# Altium project project-ui-v1.1.PrjPcb
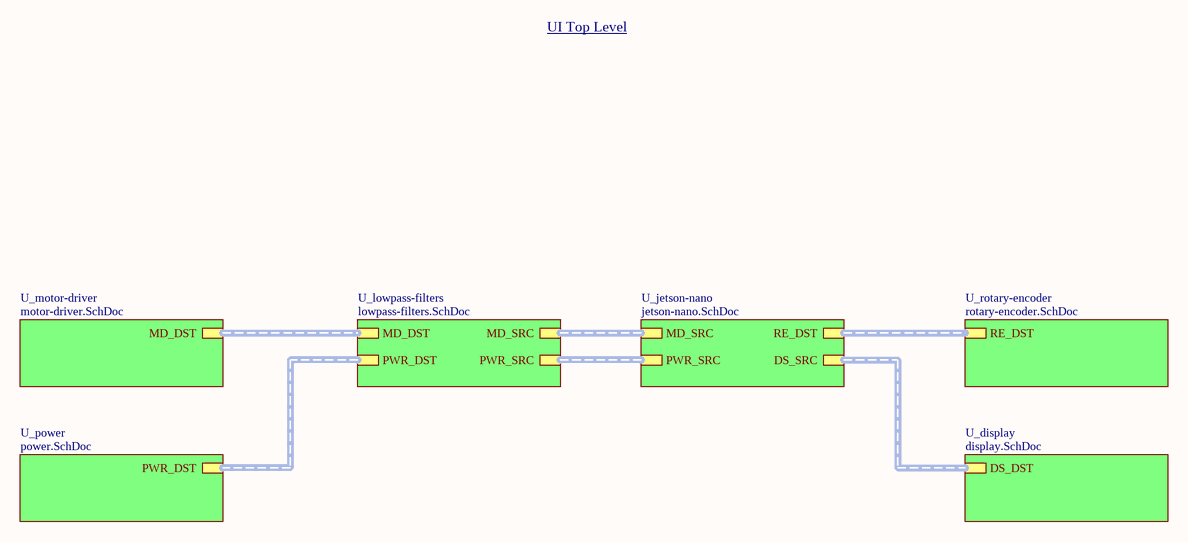
[diagram p0: ui-pcb.SchDoc]
8 sheets, 56 parts. Net scope: hierarchical (ports join the sheet entries above them; power ports are global).
Board file: ui_layout-v1.1.PcbDoc
Sheets:
  ui-pcb.SchDoc
    U_jetson-nano = jetson-nano.SchDoc
    U_lowpass-filters = lowpass-filters.SchDoc
      FL_MD_MUX_1 = low-pass-filter.SchDoc
      FL_MD_SCK = low-pass-filter.SchDoc
      FL_MD_MOSI = low-pass-filter.SchDoc
      FL_MD_MISO = low-pass-filter.SchDoc
      FL_MD_CS0 = low-pass-filter.SchDoc
      FL_MD_CS1 = low-pass-filter.SchDoc
      FL_MD_CS2 = low-pass-filter.SchDoc
      FL_MD_CS3 = low-pass-filter.SchDoc
      FL_MD_CS4 = low-pass-filter.SchDoc
      FL_MD_RESET = low-pass-filter.SchDoc
      FL_MD_EN = low-pass-filter.SchDoc
      FL_MD_MUX_0 = low-pass-filter.SchDoc
      FL_PWR_TX = low-pass-filter.SchDoc
      FL_PWR_RX = low-pass-filter.SchDoc
      FL_PWR_HRBT = low-pass-filter.SchDoc
    U_rotary-encoder = rotary-encoder.SchDoc
    U_display = display.SchDoc
    U_motor-driver = motor-driver.SchDoc
    U_power = power.SchDoc

## Sheet ui-pcb.SchDoc
size A4; SheetNumber: 1; SheetTotal: 8

### Sub-sheets
U_display = display.SchDoc: DS_DST (harness DS_SIGNALS)
U_jetson-nano = jetson-nano.SchDoc: DS_SRC (harness DS_SIGNALS), PWR_SRC (harness PWR_SIGNALS), MD_SRC (harness MD_SIGNALS), RE_DST (harness RE_SIGNALS)
U_lowpass-filters = lowpass-filters.SchDoc: PWR_SRC (harness PWR_SIGNALS), PWR_DST (harness PWR_SIGNALS), MD_SRC (harness MD_SIGNALS), MD_DST (harness MD_SIGNALS)
U_motor-driver = motor-driver.SchDoc: MD_DST (harness MD_SIGNALS)
U_power = power.SchDoc: PWR_DST (harness PWR_SIGNALS)
U_rotary-encoder = rotary-encoder.SchDoc: RE_DST (harness RE_SIGNALS)

### Buses and harness runs
harness sheet U_display/DS_DST = sheet U_jetson-nano/DS_SRC
harness sheet U_jetson-nano/MD_SRC = sheet U_lowpass-filters/MD_SRC
harness sheet U_jetson-nano/PWR_SRC = sheet U_lowpass-filters/PWR_SRC
harness sheet U_jetson-nano/RE_DST = sheet U_rotary-encoder/RE_DST
harness sheet U_lowpass-filters/MD_DST = sheet U_motor-driver/MD_DST
harness sheet U_lowpass-filters/PWR_DST = sheet U_power/PWR_DST

### Notes on the sheet
- UI Top Level

## Sheet jetson-nano.SchDoc
size A3
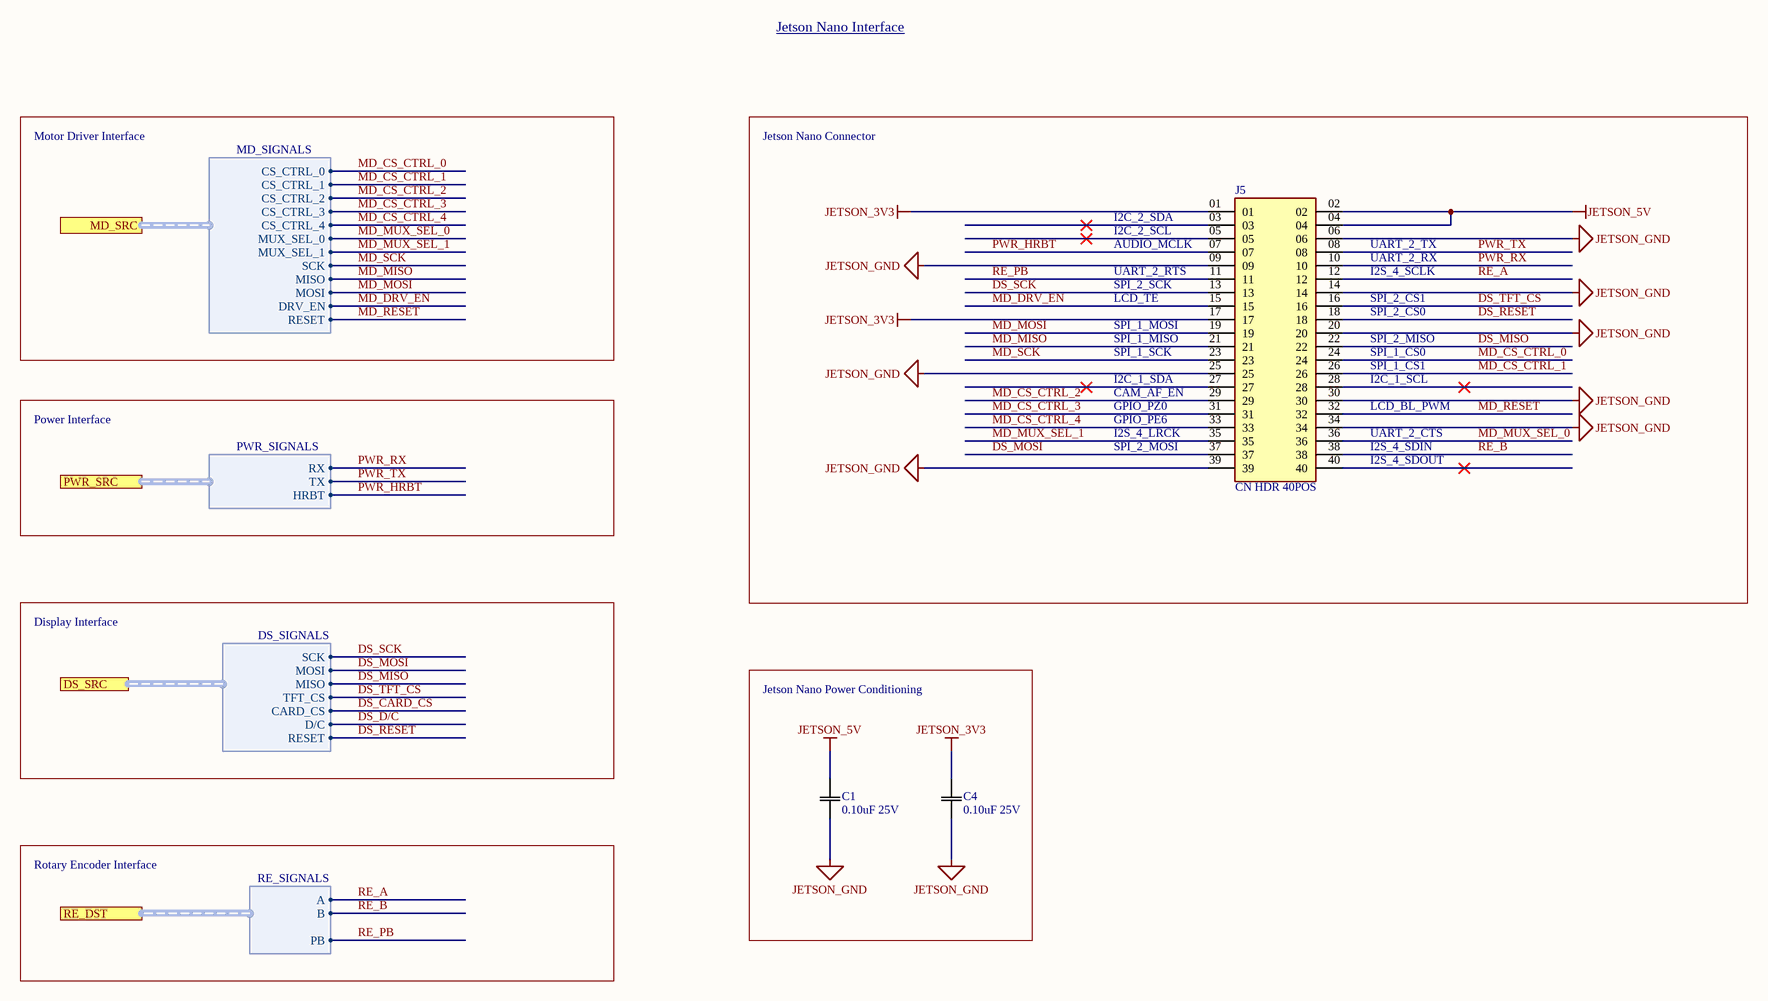
[diagram p1: jetson-nano.SchDoc]

### Parts
C1  0.10uF 25V  [0805]
C4  0.10uF 25V  [0805]
J5  CN HDR 40POS  [CN HDR 40POS 0.1 TH]

### Blocks framed on the sheet
Jetson Nano Power Conditioning: C1 C4

### Ports
DS_SRC (harness DS_SIGNALS), MD_SRC (harness MD_SIGNALS), PWR_SRC (harness PWR_SIGNALS), RE_DST (harness RE_SIGNALS)

### Harnesses
DS_SIGNALS: SCK, MOSI, MISO, TFT_CS, CARD_CS, D/C, RESET
PWR_SIGNALS: TX, RX, HRBT
MD_SIGNALS: CS_CTRL_0, MUX_SEL_1, SCK, MOSI, MISO, CS_CTRL_1, CS_CTRL_2, CS_CTRL_3, CS_CTRL_4, MUX_SEL_0, DRV_EN, RESET
RE_SIGNALS: A, B, PB

### Nets
JETSON_3V3: C4.2(C2) J5.01 J5.17
JETSON_5V: C1.2(C2) J5.02 J5.04
JETSON_GND: C1.1(C1) C4.1(C1) J5.06 J5.09 J5.14 J5.20 J5.25 J5.30 J5.34 J5.39
DS_MISO: J5.22 ; port DS_SRC.MISO
DS_MOSI: J5.37 ; port DS_SRC.MOSI
DS_RESET: J5.18 ; port DS_SRC.RESET
DS_SCK: J5.13 ; port DS_SRC.SCK
DS_TFT_CS: J5.16 ; port DS_SRC.TFT_CS
MD_CS_CTRL_0: J5.24 ; port MD_SRC.CS_CTRL_0
MD_CS_CTRL_1: J5.26 ; port MD_SRC.CS_CTRL_1
MD_CS_CTRL_2: J5.29 ; port MD_SRC.CS_CTRL_2
MD_CS_CTRL_3: J5.31 ; port MD_SRC.CS_CTRL_3
MD_CS_CTRL_4: J5.33 ; port MD_SRC.CS_CTRL_4
MD_DRV_EN: J5.15 ; port MD_SRC.DRV_EN
MD_MISO: J5.21 ; port MD_SRC.MISO
MD_MOSI: J5.19 ; port MD_SRC.MOSI  [project net MD_MISO_SRC]
MD_MUX_SEL_0: J5.36 ; port MD_SRC.MUX_SEL_0
MD_MUX_SEL_1: J5.35 ; port MD_SRC.MUX_SEL_1
MD_RESET: J5.32 ; port MD_SRC.RESET
MD_SCK: J5.23 ; port MD_SRC.SCK
PWR_HRBT: J5.07 ; port PWR_SRC.HRBT
PWR_RX: J5.10 ; port PWR_SRC.RX
PWR_TX: J5.08 ; port PWR_SRC.TX
RE_A: J5.12 ; port RE_DST.A  [project net A_SRC]
RE_B: J5.38 ; port RE_DST.B  [project net B_SRC]
RE_PB: J5.11 ; port RE_DST.PB  [project net PB_SRC]

Not connected (* = marked no-connect by the designer): J5 03* 05* 27* 28* 40*

### Notes on the sheet
- Jetson Nano Interface
- Motor Driver Interface
- Jetson Nano Connector
- AUDIO_MCLK
- UART_2_RTS
- I2C_2_SDA
- I2C_2_SCL
- I2S_4_SCLK
- UART_2_TX
- UART_2_RX
- LCD_TE
- SPI_2_SCK
- SPI_1_MOSI
- SPI_1_MISO
- SPI_2_CS1
- SPI_2_MISO
- SPI_2_CS0
- GPIO_PZ0
- CAM_AF_EN
- SPI_1_SCK
- I2C_1_SDA
- LCD_BL_PWM
- SPI_1_CS0
- SPI_1_CS1
- I2C_1_SCL
- Power Interface
- SPI_2_MOSI
- I2S_4_LRCK
- GPIO_PE6
- I2S_4_SDIN
- UART_2_CTS
- I2S_4_SDOUT
- Display Interface
- Rotary Encoder Interface

### Library data of the parts
C1 C4 = CAP 0.10uF 25V: CAP CER 0.10UF 25V X7R 0805; Value: 0.1uF; Tolerance: 10%; Temperature Coefficient: X7R; Rating: 25V; Part Number: CAP 0.10uF 25V; Operating Temperature: -55°C ~ 125°C
J5 = CN HDR 40POS: 40 Position Header Connector; Part Number: CN HDR 40POS; Supplier 1: Digi-Key; Supplier Part Number 1: S6104-ND; Supplier URL 1: https://www.digikey.ca/en/products/detail/sullins-connector-solutions/PPTC202LFBN-RC/807240?s=N4IgTCBcDaIMoDYCMAGALAWgHIBEQF0BfIA; Pin Count: 40

## Sheet lowpass-filters.SchDoc
size A3; SheetNumber: 1; SheetTotal: 6
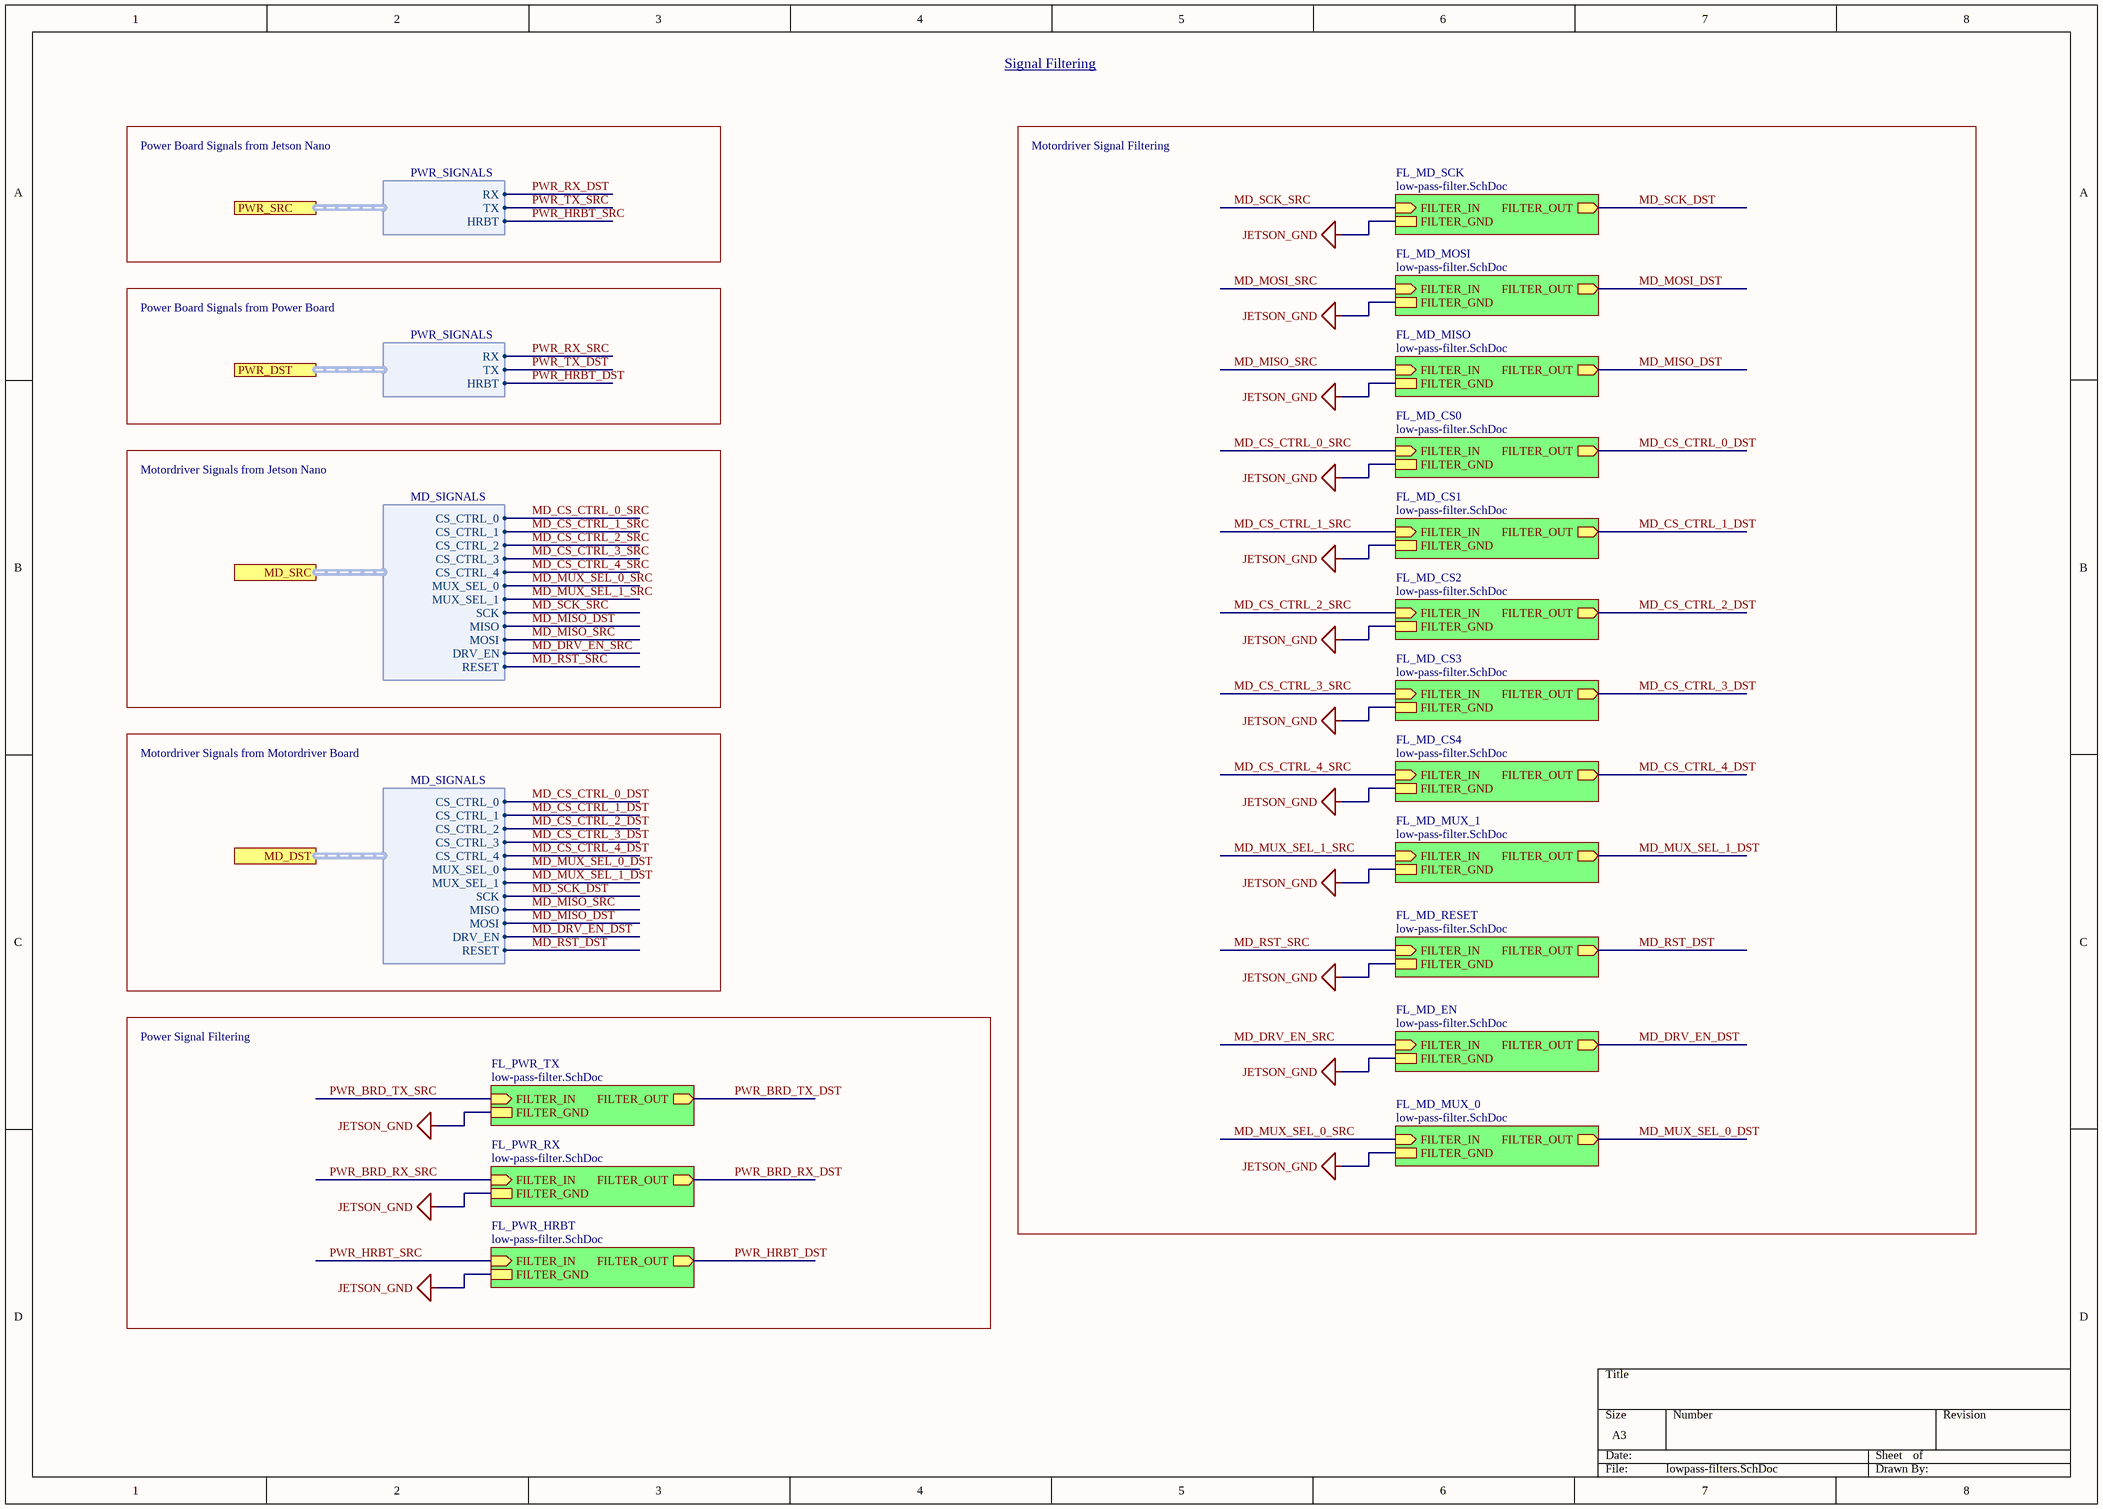
[diagram p2: lowpass-filters.SchDoc]

### Sub-sheets
FL_MD_CS0 = low-pass-filter.SchDoc: FILTER_OUT (out), FILTER_IN (in), FILTER_GND
FL_MD_CS1 = low-pass-filter.SchDoc: FILTER_OUT (out), FILTER_IN (in), FILTER_GND
FL_MD_CS2 = low-pass-filter.SchDoc: FILTER_OUT (out), FILTER_IN (in), FILTER_GND
FL_MD_CS3 = low-pass-filter.SchDoc: FILTER_OUT (out), FILTER_IN (in), FILTER_GND
FL_MD_CS4 = low-pass-filter.SchDoc: FILTER_OUT (out), FILTER_IN (in), FILTER_GND
FL_MD_EN = low-pass-filter.SchDoc: FILTER_OUT (out), FILTER_IN (in), FILTER_GND
FL_MD_MISO = low-pass-filter.SchDoc: FILTER_IN (in), FILTER_OUT (out), FILTER_GND
FL_MD_MOSI = low-pass-filter.SchDoc: FILTER_OUT (out), FILTER_IN (in), FILTER_GND
FL_MD_MUX_0 = low-pass-filter.SchDoc: FILTER_OUT (out), FILTER_IN (in), FILTER_GND
FL_MD_MUX_1 = low-pass-filter.SchDoc: FILTER_OUT (out), FILTER_IN (in), FILTER_GND
FL_MD_RESET = low-pass-filter.SchDoc: FILTER_OUT (out), FILTER_IN (in), FILTER_GND
FL_MD_SCK = low-pass-filter.SchDoc: FILTER_OUT (out), FILTER_IN (in), FILTER_GND
FL_PWR_HRBT = low-pass-filter.SchDoc: FILTER_IN (in), FILTER_OUT (out), FILTER_GND
FL_PWR_RX = low-pass-filter.SchDoc: FILTER_OUT (out), FILTER_IN (in), FILTER_GND
FL_PWR_TX = low-pass-filter.SchDoc: FILTER_OUT (out), FILTER_IN (in), FILTER_GND

### Ports
MD_DST (harness MD_SIGNALS), MD_SRC (harness MD_SIGNALS), PWR_DST (harness PWR_SIGNALS), PWR_SRC (harness PWR_SIGNALS)

### Harnesses
PWR_SIGNALS: TX, RX, HRBT
MD_SIGNALS: CS_CTRL_0, MUX_SEL_1, SCK, MOSI, MISO, CS_CTRL_1, CS_CTRL_2, CS_CTRL_3, CS_CTRL_4, MUX_SEL_0, DRV_EN, RESET

### Nets
JETSON_GND: sheet FL_MD_MUX_1/FILTER_GND, sheet FL_MD_SCK/FILTER_GND, sheet FL_MD_MOSI/FILTER_GND, sheet FL_MD_MISO/FILTER_GND, sheet FL_MD_CS0/FILTER_GND, sheet FL_MD_CS1/FILTER_GND, sheet FL_MD_CS2/FILTER_GND, sheet FL_MD_CS3/FILTER_GND, sheet FL_MD_CS4/FILTER_GND, sheet FL_MD_RESET/FILTER_GND, sheet FL_MD_EN/FILTER_GND, sheet FL_MD_MUX_0/FILTER_GND, sheet FL_PWR_TX/FILTER_GND, sheet FL_PWR_RX/FILTER_GND, sheet FL_PWR_HRBT/FILTER_GND
MD_CS_CTRL_0_DST: sheet FL_MD_CS0/FILTER_OUT, port MD_DST.CS_CTRL_0  [project net CS_CTRL_0]
MD_CS_CTRL_0_SRC: sheet FL_MD_CS0/FILTER_IN, port MD_SRC.CS_CTRL_0  [project net MD_CS_CTRL_0]
MD_CS_CTRL_1_DST: sheet FL_MD_CS1/FILTER_OUT, port MD_DST.CS_CTRL_1  [project net CS_CTRL_1]
MD_CS_CTRL_1_SRC: sheet FL_MD_CS1/FILTER_IN, port MD_SRC.CS_CTRL_1  [project net MD_CS_CTRL_1]
MD_CS_CTRL_2_DST: sheet FL_MD_CS2/FILTER_OUT, port MD_DST.CS_CTRL_2  [project net CS_CTRL_2]
MD_CS_CTRL_2_SRC: sheet FL_MD_CS2/FILTER_IN, port MD_SRC.CS_CTRL_2  [project net MD_CS_CTRL_2]
MD_CS_CTRL_3_DST: sheet FL_MD_CS3/FILTER_OUT, port MD_DST.CS_CTRL_3  [project net CS_CTRL_3]
MD_CS_CTRL_3_SRC: sheet FL_MD_CS3/FILTER_IN, port MD_SRC.CS_CTRL_3  [project net MD_CS_CTRL_3]
MD_CS_CTRL_4_DST: sheet FL_MD_CS4/FILTER_OUT, port MD_DST.CS_CTRL_4  [project net CS_CTRL_4]
MD_CS_CTRL_4_SRC: sheet FL_MD_CS4/FILTER_IN, port MD_SRC.CS_CTRL_4  [project net MD_CS_CTRL_4]
MD_DRV_EN_DST: sheet FL_MD_EN/FILTER_OUT, port MD_DST.DRV_EN  [project net DRV_EN]
MD_DRV_EN_SRC: sheet FL_MD_EN/FILTER_IN, port MD_SRC.DRV_EN  [project net MD_DRV_EN]
MD_MISO_DST: sheet FL_MD_MISO/FILTER_OUT, port MD_SRC.MISO, port MD_DST.MOSI  [project net MD_MISO]
MD_MISO_SRC: sheet FL_MD_MISO/FILTER_IN, port MD_SRC.MOSI, port MD_DST.MISO
MD_MUX_SEL_0_DST: sheet FL_MD_MUX_0/FILTER_OUT, port MD_DST.MUX_SEL_0
MD_MUX_SEL_0_SRC: sheet FL_MD_MUX_0/FILTER_IN, port MD_SRC.MUX_SEL_0  [project net MD_MUX_SEL_0]
MD_MUX_SEL_1_DST: sheet FL_MD_MUX_1/FILTER_OUT, port MD_DST.MUX_SEL_1
MD_MUX_SEL_1_SRC: sheet FL_MD_MUX_1/FILTER_IN, port MD_SRC.MUX_SEL_1  [project net MD_MUX_SEL_1]
MD_RST_DST: sheet FL_MD_RESET/FILTER_OUT, port MD_DST.RESET
MD_RST_SRC: sheet FL_MD_RESET/FILTER_IN, port MD_SRC.RESET  [project net MD_RESET]
MD_SCK_DST: sheet FL_MD_SCK/FILTER_OUT, port MD_DST.SCK
MD_SCK_SRC: sheet FL_MD_SCK/FILTER_IN, port MD_SRC.SCK  [project net MD_SCK]
PWR_HRBT_DST: sheet FL_PWR_HRBT/FILTER_OUT, port PWR_DST.HRBT  [project net HRBT]
PWR_HRBT_SRC: sheet FL_PWR_HRBT/FILTER_IN, port PWR_SRC.HRBT  [project net PWR_HRBT]

### Notes on the sheet
- Signal Filtering
- Power Board Signals from Jetson Nano
- Motordriver Signal Filtering
- Power Board Signals from Power Board
- Motordriver Signals from Jetson Nano
- Motordriver Signals from Motordriver Board
- Power Signal Filtering

## Sheet low-pass-filter.SchDoc
size A4
Used 15 times, as channels U_lowpass-filters/FL_MD_MUX_1, U_lowpass-filters/FL_MD_SCK, U_lowpass-filters/FL_MD_MOSI, U_lowpass-filters/FL_MD_MISO, U_lowpass-filters/FL_MD_CS0, U_lowpass-filters/FL_MD_CS1, U_lowpass-filters/FL_MD_CS2, U_lowpass-filters/FL_MD_CS3, U_lowpass-filters/FL_MD_CS4, U_lowpass-filters/FL_MD_RESET, U_lowpass-filters/FL_MD_EN, U_lowpass-filters/FL_MD_MUX_0, U_lowpass-filters/FL_PWR_TX, U_lowpass-filters/FL_PWR_RX, U_lowpass-filters/FL_PWR_HRBT. Parts and nets are listed once, with the designators drawn on the sheet.
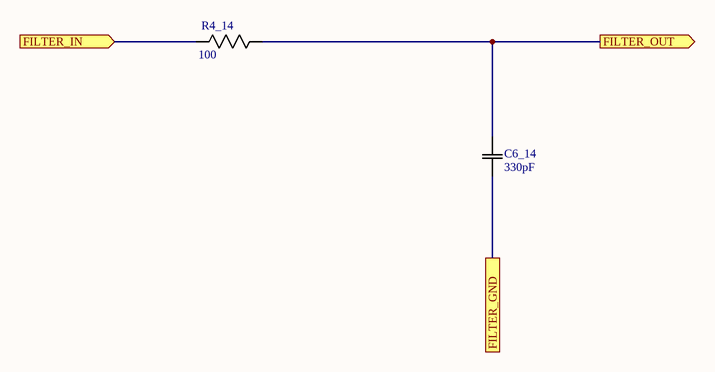
[diagram p3: low-pass-filter.SchDoc]

### Parts
C6_14  330pF  [0805]
R4_14  100  [0805]

### Ports
FILTER_GND, FILTER_IN (in), FILTER_OUT (out)

### Nets
FILTER_GND: C6_14.1(C1) ; port FILTER_GND
FILTER_IN: R4_14.2(R2) ; port FILTER_IN
FILTER_OUT: C6_14.2(C2) R4_14.1(R1) ; port FILTER_OUT

### Channels
U_lowpass-filters/FL_MD_MUX_1: designators end in J; ports FILTER_GND=JETSON_GND FILTER_IN=MD_MUX_SEL_1 FILTER_OUT=MD_MUX_SEL_1_DST
U_lowpass-filters/FL_MD_SCK: designators end in L; ports FILTER_GND=JETSON_GND FILTER_IN=MD_SCK FILTER_OUT=MD_SCK_DST
U_lowpass-filters/FL_MD_MOSI: designators end in H; ports FILTER_GND=JETSON_GND FILTER_IN=MD_MOSI_SRC FILTER_OUT=MD_MOSI_DST
U_lowpass-filters/FL_MD_MISO: designators end in G; ports FILTER_GND=JETSON_GND FILTER_IN=MD_MISO_SRC FILTER_OUT=MD_MISO
U_lowpass-filters/FL_MD_CS0: designators end in A; ports FILTER_GND=JETSON_GND FILTER_IN=MD_CS_CTRL_0 FILTER_OUT=CS_CTRL_0
U_lowpass-filters/FL_MD_CS1: designators end in B; ports FILTER_GND=JETSON_GND FILTER_IN=MD_CS_CTRL_1 FILTER_OUT=CS_CTRL_1
U_lowpass-filters/FL_MD_CS2: designators end in C; ports FILTER_GND=JETSON_GND FILTER_IN=MD_CS_CTRL_2 FILTER_OUT=CS_CTRL_2
U_lowpass-filters/FL_MD_CS3: designators end in D; ports FILTER_GND=JETSON_GND FILTER_IN=MD_CS_CTRL_3 FILTER_OUT=CS_CTRL_3
U_lowpass-filters/FL_MD_CS4: designators end in E; ports FILTER_GND=JETSON_GND FILTER_IN=MD_CS_CTRL_4 FILTER_OUT=CS_CTRL_4
U_lowpass-filters/FL_MD_RESET: designators end in K; ports FILTER_GND=JETSON_GND FILTER_IN=MD_RESET FILTER_OUT=MD_RST_DST
U_lowpass-filters/FL_MD_EN: designators end in F; ports FILTER_GND=JETSON_GND FILTER_IN=MD_DRV_EN FILTER_OUT=DRV_EN
U_lowpass-filters/FL_MD_MUX_0: designators end in I; ports FILTER_GND=JETSON_GND FILTER_IN=MD_MUX_SEL_0 FILTER_OUT=MD_MUX_SEL_0_DST
U_lowpass-filters/FL_PWR_TX: designators end in O; ports FILTER_GND=JETSON_GND FILTER_IN=PWR_BRD_TX_SRC FILTER_OUT=PWR_BRD_TX_DST
U_lowpass-filters/FL_PWR_RX: designators end in N; ports FILTER_GND=JETSON_GND FILTER_IN=PWR_BRD_RX_SRC FILTER_OUT=PWR_BRD_RX_DST
U_lowpass-filters/FL_PWR_HRBT: designators end in M; ports FILTER_GND=JETSON_GND FILTER_IN=PWR_HRBT FILTER_OUT=HRBT

### Library data of the parts
C6_14 = CAP 330pF 16V: CAP CER 330PF 16V X5R 0603/0805; Tolerance: 10%; Part Number: CAP 330pF 16V; Value: 330pF; Rating: 16V; Temperature Coefficient: X5R; Package: 0603/0805; Operating Temperature: -55°C ~ 85°C
R4_14 = RES 100.0 1/8W 5%: RES SMD 100 OHM 5% 1/8W 0805; Manufacturer Part Number 1: RK73B1JRTTD101J; Power (Watts): 0.125W; Package: 0805; Value: 100; Tolerance: 5%; Part Number: RES 100.0 1/8W 5%; Supplier 1: Digi-Key; Supplier Part Number 1: 2019-RK73B1JRTTD101JCT-ND; Supplier URL 1: https://www.digikey.ca/en/products/detail/koa-speer-electronics-inc/RK73B1JRTTD101J/12156165?s=N4IgTCBcDaIEoGkDsBmAQgRgFJwCq4BEMAGbAYVxAF0BfIA; Manufacturer Part Number 2: RMCF0805JT100R; Supplier 2: Digi-Key; Supplier Part Number 2: RMCF0805JT100RCT-ND; Supplier URL 2: https://www.digikey.ca/en/products/detail/stackpole-electronics-inc/RMCF0805JT100R/1757756?s=N4IgTCBcDaIEoFkDCAxADADjQVgFIBUBGNNOJfEAXQF8g; Tolerance 2: 5%

## Sheet rotary-encoder.SchDoc
size A4; SheetNumber: 9; SheetTotal: 9
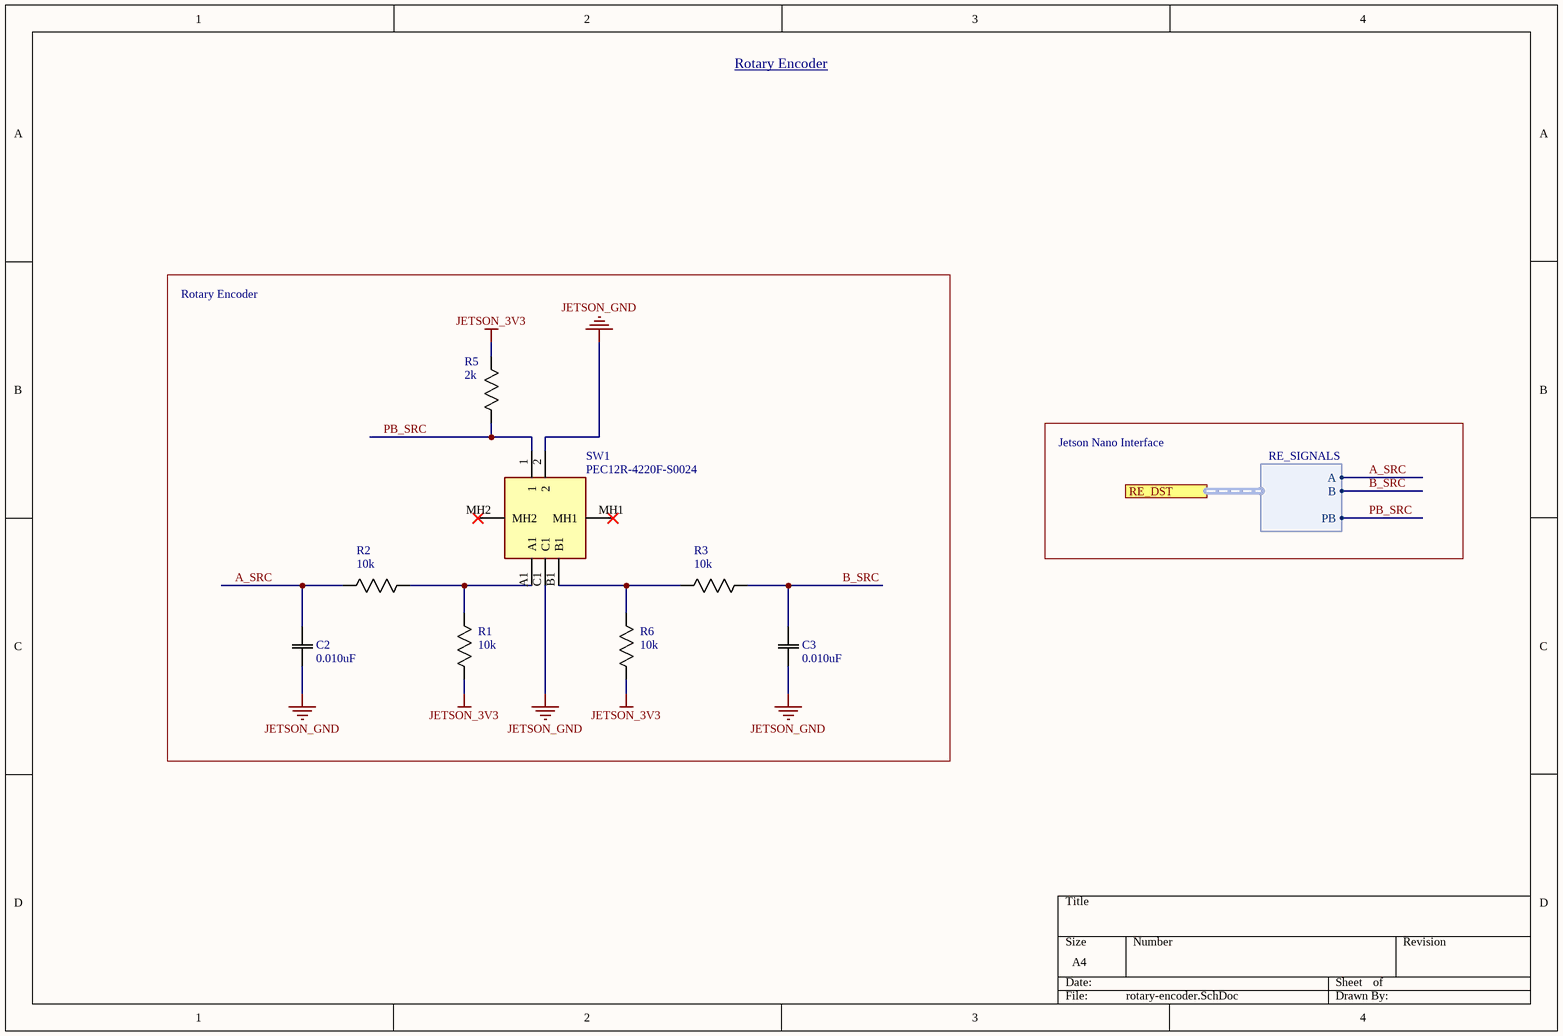
[diagram p4: rotary-encoder.SchDoc]

### Parts
C2  0.010uF  [0603]
C3  0.010uF  [0603]
R1  10k  [0805]
R2  10k  [0805]
R3  10k  [0805]
R5  2k  [0603]
R6  10k  [0805]
SW1  PEC12R-4220F-S0024  [PEC12R4220FS0024]

### Blocks framed on the sheet
Rotary Encoder: C2 C3 R1-R3 R5 R6 SW1

### Ports
RE_DST (harness RE_SIGNALS)

### Harnesses
RE_SIGNALS: A, B, PB

### Nets
JETSON_3V3: R1.2(R2) R5.1(R1) R6.2(R2)
JETSON_GND: C2.1(C1) C3.1(C1) SW1.2 SW1.C1
A_SRC: C2.2(C2) R2.2(R2) ; port RE_DST.A
B_SRC: C3.2(C2) R3.1(R1) ; port RE_DST.B
PB_SRC: R5.2(R2) SW1.1 ; port RE_DST.PB
NetR1_1: R1.1(R1) R2.1(R1) SW1.A1
NetR3_2: R3.2(R2) R6.1(R1) SW1.B1

Not connected (* = marked no-connect by the designer): SW1 MH1* MH2*

### Notes on the sheet
- Rotary Encoder
- Jetson Nano Interface

### Library data of the parts
C2 C3 = CAP 0.010uF 16V: CAP CER 0.010UF 16V X5R 0603/0805; Tolerance: 10%; Value: 0.010uF; Temperature Coefficient: X5R; Rating: 16V; Part Number: CAP 0.010uF 16V; Package: 0603/0805; Operating Temperature: -55°C ~ 85°C
R1-R3 R6 = RES 10k 1/8W 1%: RES SMD 10K OHM 1% 1/8W 0805; Manufacturer Part Number 1: ERJ-H3GJ103V; Power (Watts): 0.125W; Tolerance: 5%; Package: 0805; Value: 10k; Part Number: RES 10k 1/8W 1%; Supplier 1: Digi-Key; Supplier Part Number 1: 10-ERJ-H3GJ103VCT-ND; Supplier URL 1: https://www.digikey.ca/en/products/detail/panasonic-electronic-components/ERJ-H3GJ103V/13877876?s=N4IgTCBcDaIIwAYC0BRASgKSQCQMwHENFcA1AYQBUkA5AERAF0BfIA; Manufacturer Part Number 2: RMCF0805JT10K0; Supplier 2: Digi-Key; Supplier Part Number 2: RMCF0805JT10K0CT-ND; Supplier URL 2: https://www.digikey.ca/en/products/detail/stackpole-electronics-inc/RMCF0805JT10K0/1757762?s=N4IgTCBcDaIEoFkDCAxADADjQVgFIBUBGNAaTSXxAF0BfIA; Tolerance 2: 5%
R5 = RES 2k 1/8W: RES SMD 2K OHM 5% 1/8W 0805; Power (Watts): 0.125W; Package: 0805; Value: 2k; Tolerance: 5%; Part Number: RES 2k 1/8W
SW1 = PEC12R4220FS0024: Rotary Encoder; Manufacturer_Name: Bourns; Datasheet Link: https://componentsearchengine.com/Datasheets/5/PEC12R-4220F-S0024.pdf; Height: 20mm; Manufacturer_Part_Number: PEC12R-4220F-S0024; Mouser Part Number: 652-PEC12R-4220F-S24; Mouser Price/Stock: https://www.mouser.co.uk/ProductDetail/Bourns/PEC12R-4220F-S0024?qs=Zq5ylnUbLm7u%2FuPQvUoR4Q%3D%3D; Arrow Part Number: PEC12R-4220F-S0024; Arrow Price/Stock: https://www.arrow.com/en/products/pec12r-4220f-s0024/bourns; Part Number: PEC12R4220FS0024; Supplier 1: Digi-key; Supplier Part Number 1: PEC12R-4220F-S0024-ND; Supplier URL 1: https://www.digikey.ca/en/products/detail/bourns-inc/PEC12R-4220F-S0024/4499653

## Sheet display.SchDoc
size A4; SheetNumber: 8; SheetTotal: 8
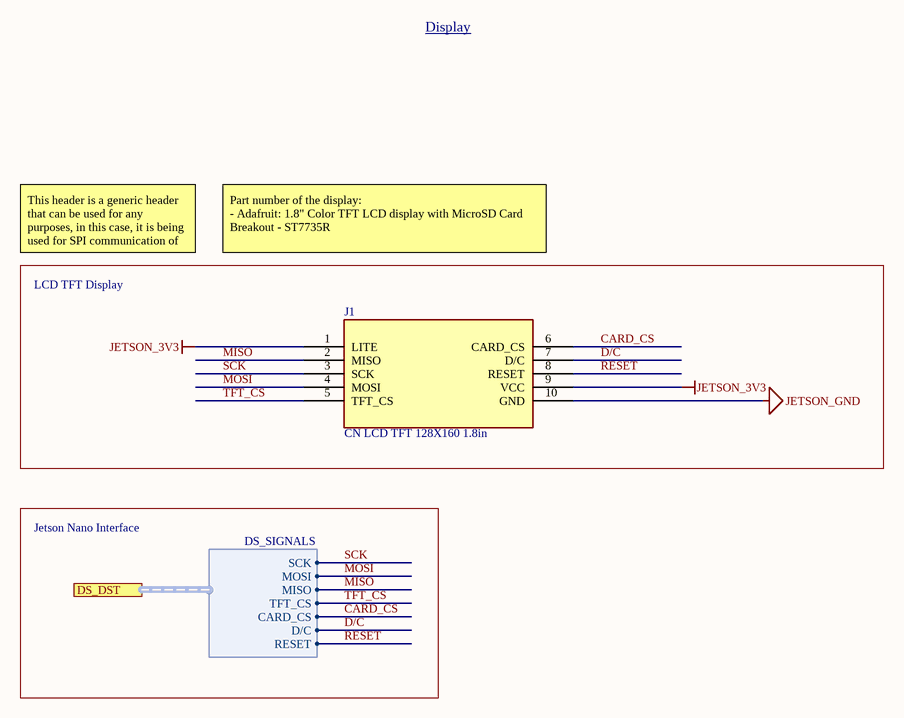
[diagram p5: display.SchDoc]

### Parts
J1  CN LCD TFT 128X160 1.8in  [CN LCD TFT 128X160 1.8in]

### Blocks framed on the sheet
LCD TFT Display: J1

### Ports
DS_DST (harness DS_SIGNALS)

### Harnesses
DS_SIGNALS: SCK, MOSI, MISO, TFT_CS, CARD_CS, D/C, RESET

### Nets
JETSON_3V3: J1.1(LITE) J1.9(VCC)
JETSON_GND: J1.10(GND)
CARD_CS: J1.6(CARD_CS) ; port DS_DST.CARD_CS
D/C: J1.7(D/C) ; port DS_DST.D/C
MISO: J1.2(MISO) ; port DS_DST.MISO  [project net DS_MISO]
MOSI: J1.4(MOSI) ; port DS_DST.MOSI  [project net DS_MOSI]
RESET: J1.8(RESET) ; port DS_DST.RESET  [project net DS_RESET]
SCK: J1.3(SCK) ; port DS_DST.SCK  [project net DS_SCK]
TFT_CS: J1.5(TFT_CS) ; port DS_DST.TFT_CS  [project net DS_TFT_CS]

### Notes on the sheet
- Display
- This header is a generic header that can be used for any purposes, in this case, it is being used for SPI communication of the display
- Part number of the display:
  - Adafruit: 1.8" Color TFT LCD display with MicroSD Card Breakout - ST7735R
- Jetson Nano Interface

### Library data of the parts
J1 = CN LCD TFT 128X160 1.8in: Graphic LCD Display Module Transmissive Red, Green, Blue (RGB) TFT - Color SPI 1.8" (45.72mm) 128 x 160; Manufacturer Part Number 1: 358; Part Number: CN LCD TFT 128X160 1.8in; Supplier 1: Digi-Key; Supplier Part Number 1: 1528-1536-ND; Supplier URL 1: https://www.digikey.ca/en/products/detail/adafruit-industries-llc/358/5801368; Pin Count: 10

## Sheet motor-driver.SchDoc
size A
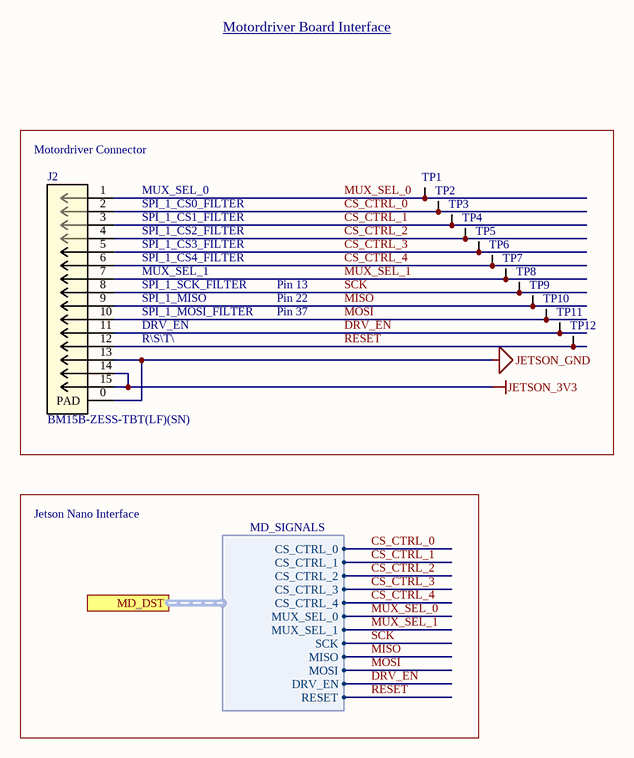
[diagram p6: motor-driver.SchDoc]

### Parts
J2  BM15B-ZESS-TBT(LF)(SN)  [JST ZE SMT 15POS]
TP1  Test Point (Via)  [TP]  (value not drawn)  (no BOM)
TP2  Test Point (Via)  [TP]  (value not drawn)  (no BOM)
TP3  Test Point (Via)  [TP]  (value not drawn)  (no BOM)
TP4  Test Point (Via)  [TP]  (value not drawn)  (no BOM)
TP5  Test Point (Via)  [TP]  (value not drawn)  (no BOM)
TP6  Test Point (Via)  [TP]  (value not drawn)  (no BOM)
TP7  Test Point (Via)  [TP]  (value not drawn)  (no BOM)
TP8  Test Point (Via)  [TP]  (value not drawn)  (no BOM)
TP9  Test Point (Via)  [TP]  (value not drawn)  (no BOM)
TP10  Test Point (Via)  [TP]  (value not drawn)  (no BOM)
TP11  Test Point (Via)  [TP]  (value not drawn)  (no BOM)
TP12  Test Point (Via)  [TP]  (value not drawn)  (no BOM)

### Ports
MD_DST (harness MD_SIGNALS)

### Harnesses
MD_SIGNALS: CS_CTRL_0, MUX_SEL_1, SCK, MOSI, MISO, CS_CTRL_1, CS_CTRL_2, CS_CTRL_3, CS_CTRL_4, MUX_SEL_0, DRV_EN, RESET

### Nets
JETSON_3V3: J2.14 J2.15
JETSON_GND: J2.0(PAD) J2.13
CS_CTRL_0: J2.2 TP2.1 ; port MD_DST.CS_CTRL_0
CS_CTRL_1: J2.3 TP3.1 ; port MD_DST.CS_CTRL_1
CS_CTRL_2: J2.4 TP4.1 ; port MD_DST.CS_CTRL_2
CS_CTRL_3: J2.5 TP5.1 ; port MD_DST.CS_CTRL_3
CS_CTRL_4: J2.6 TP6.1 ; port MD_DST.CS_CTRL_4
DRV_EN: J2.11 TP11.1 ; port MD_DST.DRV_EN
MISO: J2.9 TP9.1 ; port MD_DST.MISO  [project net MD_MISO_SRC]
MOSI: J2.10 TP10.1 ; port MD_DST.MOSI  [project net MD_MISO]
MUX_SEL_0: J2.1 TP1.1 ; port MD_DST.MUX_SEL_0  [project net MD_MUX_SEL_0_DST]
MUX_SEL_1: J2.7 TP7.1 ; port MD_DST.MUX_SEL_1  [project net MD_MUX_SEL_1_DST]
RESET: J2.12 TP12.1 ; port MD_DST.RESET  [project net MD_RST_DST]
SCK: J2.8 TP8.1 ; port MD_DST.SCK  [project net MD_SCK_DST]

### Notes on the sheet
- Motordriver Board Interface
- (near J2) Motordriver Connector
- MUX_SEL_0
- SPI_1_CS0_FILTER
- SPI_1_CS1_FILTER
- SPI_1_CS2_FILTER
- SPI_1_CS3_FILTER
- SPI_1_CS4_FILTER
- DRV_EN
- SPI_1_SCK_FILTER
- SPI_1_MISO
- SPI_1_MOSI_FILTER
- MUX_SEL_1
- Pin 37
- Pin 22
- Pin 13
- R\S\T\
- Jetson Nano Interface

### Library data of the parts
J2 = CN 15POS JST ZE SMT: CONN HEADER VERT SMD 15POS ZE; Supplier 1: Digi-Key; Supplier Part Number 1: 455-4211-1-ND; Part Number: CN 15POS JST ZE SMT; Manufacturer Part Number 1: BM15B-ZESS-TBT(LF)(SN); Supplier URL 1: https://www.digikey.ca/en/products/detail/jst-sales-america-inc/BM15B-ZESS-TBT-LF-SN/1886999?s=N4IgTCBcDaIEIFkCMBWOBaAWgUQMq-QBU5CAKAGQDEBKU3AOWpAF0BfIA; Pin Count: 15
TP1-TP12 = Test Point (Via): Part Number: Test Point (Via)

## Sheet power.SchDoc
size A4; SheetNumber: 3; SheetTotal: 4
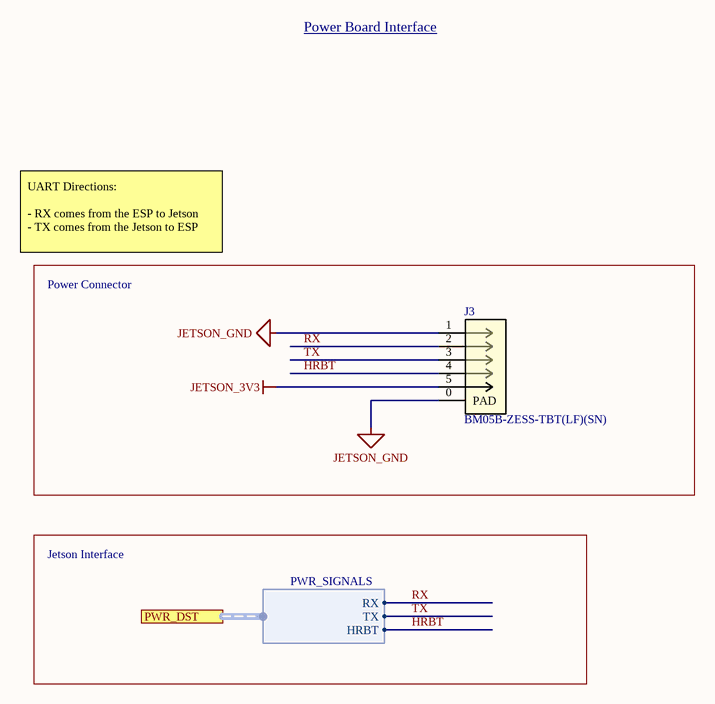
[diagram p7: power.SchDoc]

### Parts
J3  BM05B-ZESS-TBT(LF)(SN)  [JST ZE SMT 5POS]

### Blocks framed on the sheet
Power Connector: J3

### Ports
PWR_DST (harness PWR_SIGNALS)

### Harnesses
PWR_SIGNALS: TX, RX, HRBT

### Nets
JETSON_3V3: J3.5
JETSON_GND: J3.0(PAD) J3.1
HRBT: J3.4 ; port PWR_DST.HRBT
RX: J3.2 ; port PWR_DST.RX  [project net PWR_RX_SRC]
TX: J3.3 ; port PWR_DST.TX  [project net PWR_TX_DST]

### Notes on the sheet
- Power Board Interface
- UART Directions:
  - RX comes from the ESP to Jetson
  - TX comes from the Jetson to ESP
- Jetson Interface

### Library data of the parts
J3 = CN 5POS JST ZE SMT: CONN HEADER VERT SMD 5POS ZE; Part Number: CN 5POS JST ZE SMT; Supplier 1: Digi-Key; Supplier Part Number 1: 455-2383-1-ND; Supplier URL 1: https://www.digikey.ca/en/products/detail/jst-sales-america-inc/BM05B-ZESS-TBT-LF-SN/1886989?s=N4IgTCBcDaIEIFkAMBWOBaAWgUQMq-QBU5CAKAGQDEBKU3AOWpAF0BfIA; Pin Count: 5; Manufacturer Part Number 1: BM05B-ZESS-TBT(LF)(SN)

## Nets that join several sheets
JETSON_3V3: jetson-nano (C4.2 J5.01 J5.17), rotary-encoder (R1.2 R5.1 R6.2), display (J1.1 J1.9), motor-driver (J2.14 J2.15), power (J3.5)
JETSON_GND: jetson-nano (10 pins), U_lowpass-filters/FL_MD_MUX_1 (C6_14J.1), U_lowpass-filters/FL_MD_SCK (C6_14L.1), U_lowpass-filters/FL_MD_MOSI (C6_14H.1), U_lowpass-filters/FL_MD_MISO (C6_14G.1), U_lowpass-filters/FL_MD_CS0 (C6_14A.1), U_lowpass-filters/FL_MD_CS1 (C6_14B.1), U_lowpass-filters/FL_MD_CS2 (C6_14C.1), U_lowpass-filters/FL_MD_CS3 (C6_14D.1), U_lowpass-filters/FL_MD_CS4 (C6_14E.1), U_lowpass-filters/FL_MD_RESET (C6_14K.1), U_lowpass-filters/FL_MD_EN (C6_14F.1), U_lowpass-filters/FL_MD_MUX_0 (C6_14I.1), U_lowpass-filters/FL_PWR_TX (C6_14O.1), U_lowpass-filters/FL_PWR_RX (C6_14N.1), U_lowpass-filters/FL_PWR_HRBT (C6_14M.1), rotary-encoder (C2.1 C3.1 SW1.2 SW1.C1), display (J1.10), motor-driver (J2.0 J2.13), power (J3.0 J3.1)
A_SRC: jetson-nano (J5.12), rotary-encoder (C2.2 R2.2)
B_SRC: jetson-nano (J5.38), rotary-encoder (C3.2 R3.1)
CS_CTRL_0: U_lowpass-filters/FL_MD_CS0 (C6_14A.2 R4_14A.1), motor-driver (J2.2 TP2.1)
CS_CTRL_1: U_lowpass-filters/FL_MD_CS1 (C6_14B.2 R4_14B.1), motor-driver (J2.3 TP3.1)
CS_CTRL_2: U_lowpass-filters/FL_MD_CS2 (C6_14C.2 R4_14C.1), motor-driver (J2.4 TP4.1)
CS_CTRL_3: U_lowpass-filters/FL_MD_CS3 (C6_14D.2 R4_14D.1), motor-driver (J2.5 TP5.1)
CS_CTRL_4: U_lowpass-filters/FL_MD_CS4 (C6_14E.2 R4_14E.1), motor-driver (J2.6 TP6.1)
DRV_EN: U_lowpass-filters/FL_MD_EN (C6_14F.2 R4_14F.1), motor-driver (J2.11 TP11.1)
DS_MISO: jetson-nano (J5.22), display (J1.2)
DS_MOSI: jetson-nano (J5.37), display (J1.4)
DS_RESET: jetson-nano (J5.18), display (J1.8)
DS_SCK: jetson-nano (J5.13), display (J1.3)
DS_TFT_CS: jetson-nano (J5.16), display (J1.5)
HRBT: U_lowpass-filters/FL_PWR_HRBT (C6_14M.2 R4_14M.1), power (J3.4)
MD_CS_CTRL_0: jetson-nano (J5.24), U_lowpass-filters/FL_MD_CS0 (R4_14A.2)
MD_CS_CTRL_1: jetson-nano (J5.26), U_lowpass-filters/FL_MD_CS1 (R4_14B.2)
MD_CS_CTRL_2: jetson-nano (J5.29), U_lowpass-filters/FL_MD_CS2 (R4_14C.2)
MD_CS_CTRL_3: jetson-nano (J5.31), U_lowpass-filters/FL_MD_CS3 (R4_14D.2)
MD_CS_CTRL_4: jetson-nano (J5.33), U_lowpass-filters/FL_MD_CS4 (R4_14E.2)
MD_DRV_EN: jetson-nano (J5.15), U_lowpass-filters/FL_MD_EN (R4_14F.2)
MD_MISO: jetson-nano (J5.21), U_lowpass-filters/FL_MD_MISO (C6_14G.2 R4_14G.1), motor-driver (J2.10 TP10.1)
MD_MISO_SRC: jetson-nano (J5.19), U_lowpass-filters/FL_MD_MISO (R4_14G.2), motor-driver (J2.9 TP9.1)
MD_MUX_SEL_0: jetson-nano (J5.36), U_lowpass-filters/FL_MD_MUX_0 (R4_14I.2)
MD_MUX_SEL_0_DST: U_lowpass-filters/FL_MD_MUX_0 (C6_14I.2 R4_14I.1), motor-driver (J2.1 TP1.1)
MD_MUX_SEL_1: jetson-nano (J5.35), U_lowpass-filters/FL_MD_MUX_1 (R4_14J.2)
MD_MUX_SEL_1_DST: U_lowpass-filters/FL_MD_MUX_1 (C6_14J.2 R4_14J.1), motor-driver (J2.7 TP7.1)
MD_RESET: jetson-nano (J5.32), U_lowpass-filters/FL_MD_RESET (R4_14K.2)
MD_RST_DST: U_lowpass-filters/FL_MD_RESET (C6_14K.2 R4_14K.1), motor-driver (J2.12 TP12.1)
MD_SCK: jetson-nano (J5.23), U_lowpass-filters/FL_MD_SCK (R4_14L.2)
MD_SCK_DST: U_lowpass-filters/FL_MD_SCK (C6_14L.2 R4_14L.1), motor-driver (J2.8 TP8.1)
PB_SRC: jetson-nano (J5.11), rotary-encoder (R5.2 SW1.1)
PWR_HRBT: jetson-nano (J5.07), U_lowpass-filters/FL_PWR_HRBT (R4_14M.2)

## Assembly variants
No FL: not fitted C6_14A C6_14B C6_14C C6_14D C6_14E C6_14F C6_14G C6_14H C6_14I C6_14J C6_14K C6_14L C6_14M C6_14N C6_14O; alternate parts R4_14G -> RES 0 JUMPER, R4_14F -> RES 0 JUMPER, R4_14E -> RES 0 JUMPER, R4_14D -> RES 0 JUMPER, R4_14C -> RES 0 JUMPER, R4_14B -> RES 0 JUMPER, R4_14A -> RES 0 JUMPER, R4_14H -> RES 0 JUMPER, R4_14I -> RES 0 JUMPER, R4_14J -> RES 0 JUMPER, R4_14K -> RES 0 JUMPER, R4_14L -> RES 0 JUMPER, R4_14M -> RES 0 JUMPER, R4_14N -> RES 0 JUMPER, R4_14O -> RES 0 JUMPER